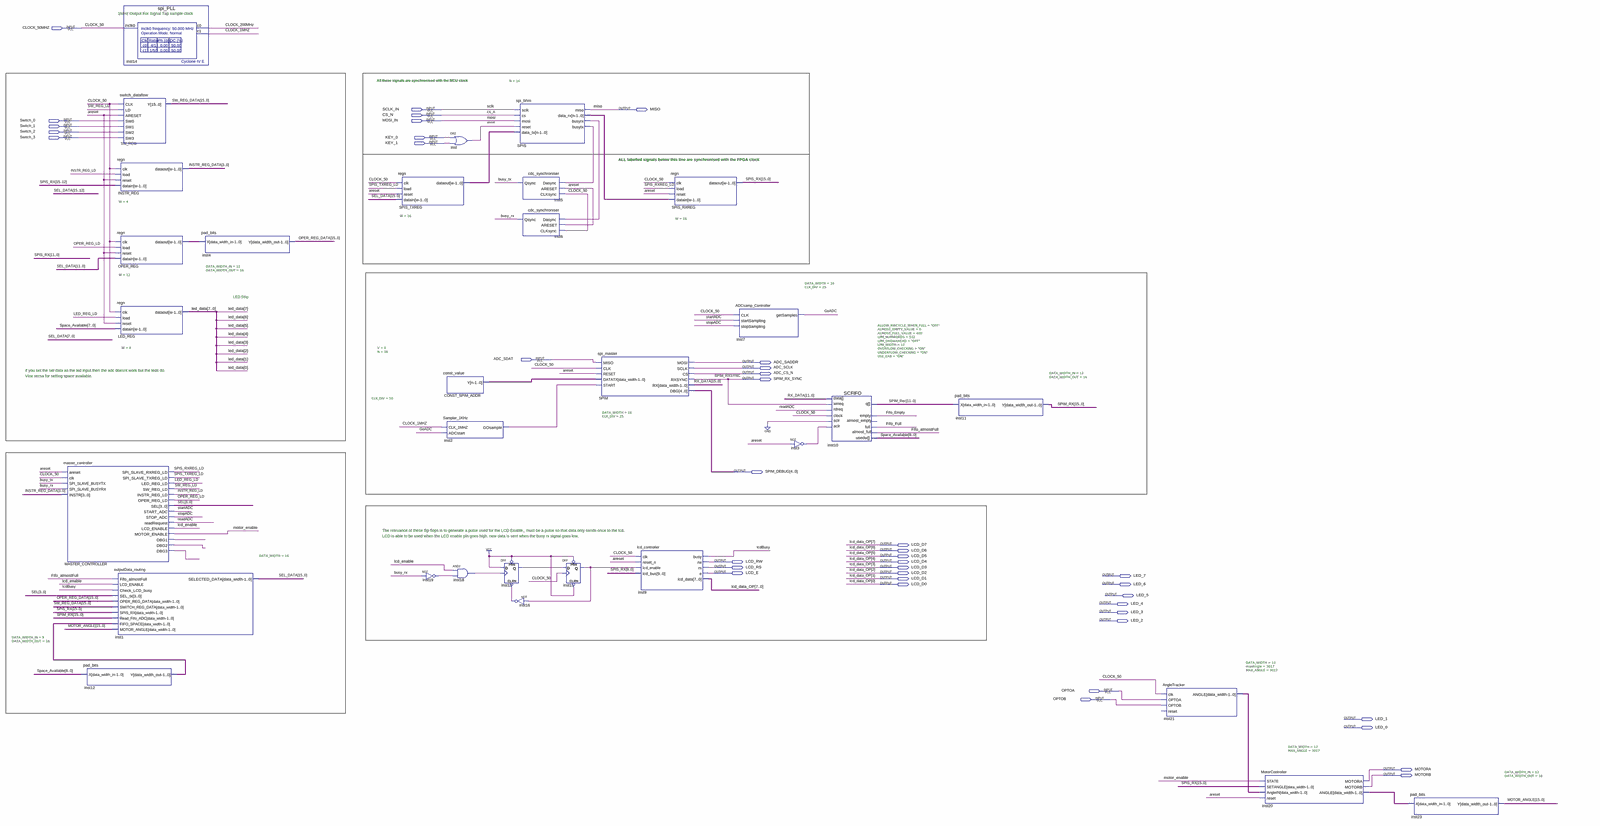
[diagram p0: schematic sheet, whole]
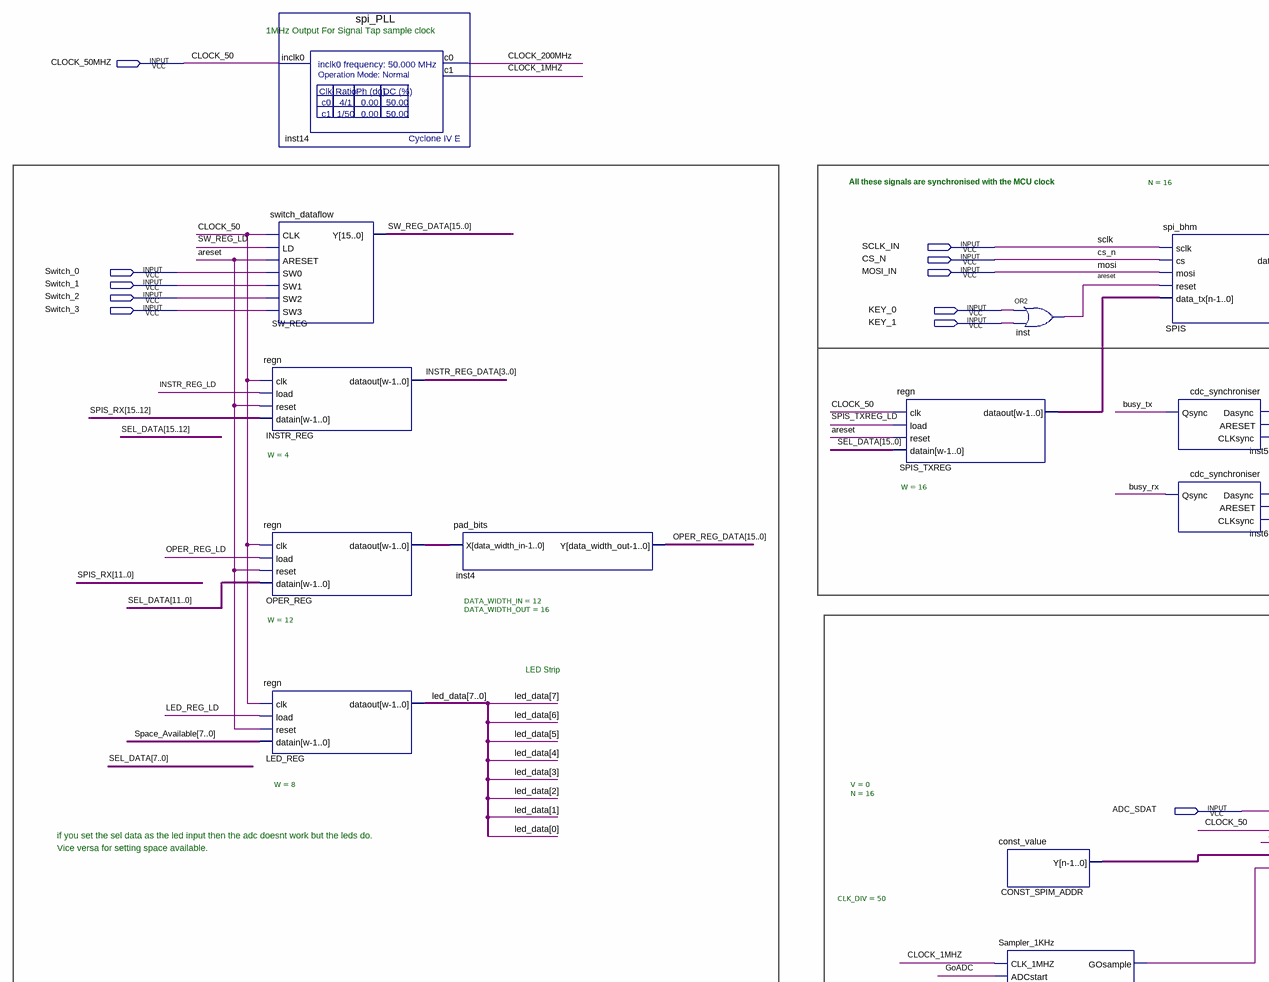
[diagram p1: schematic sheet, upper left part]
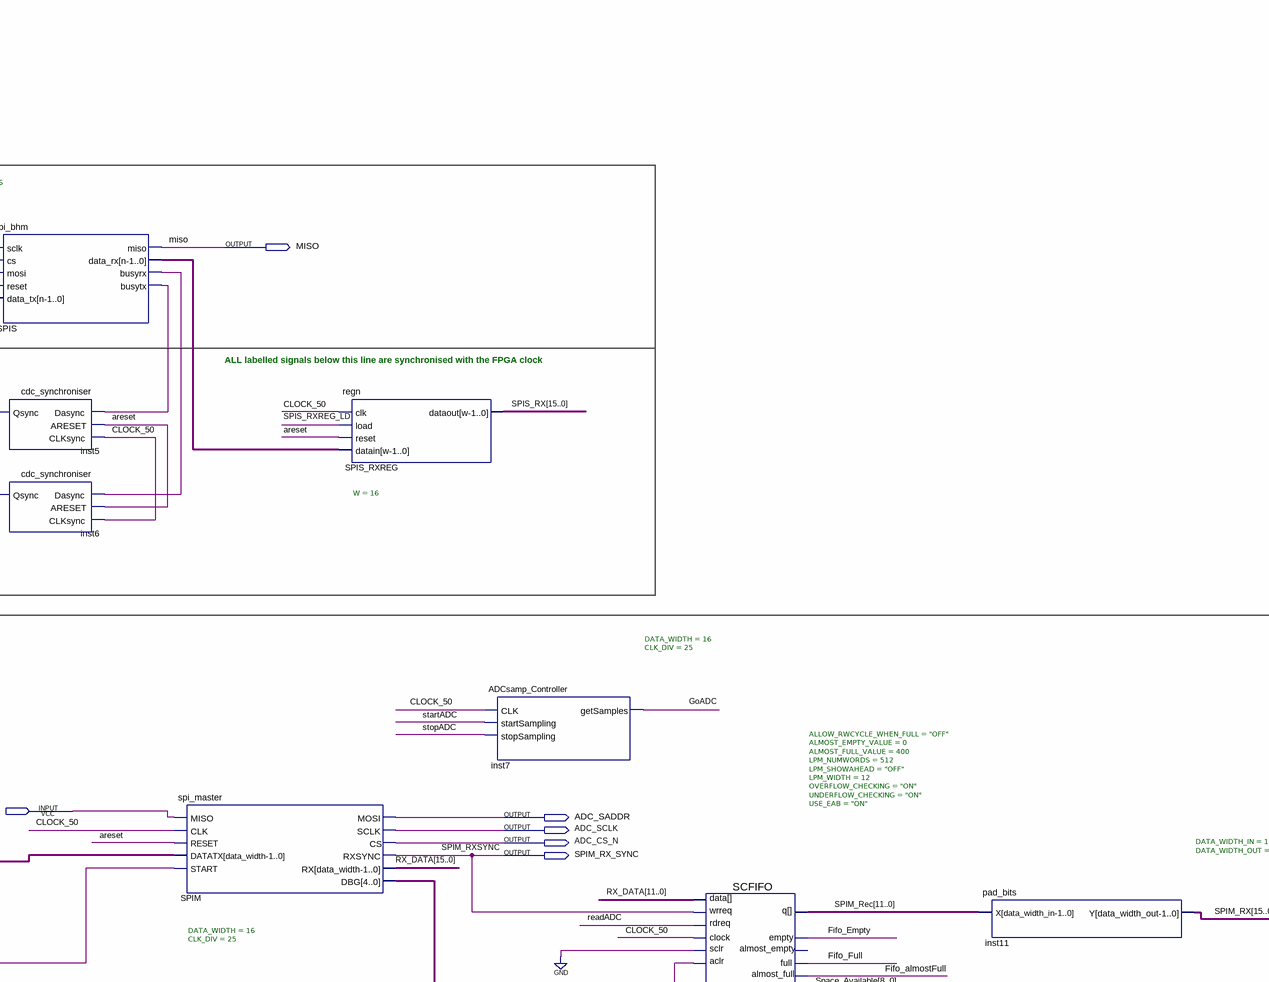
[diagram p2: schematic sheet, upper centre part]
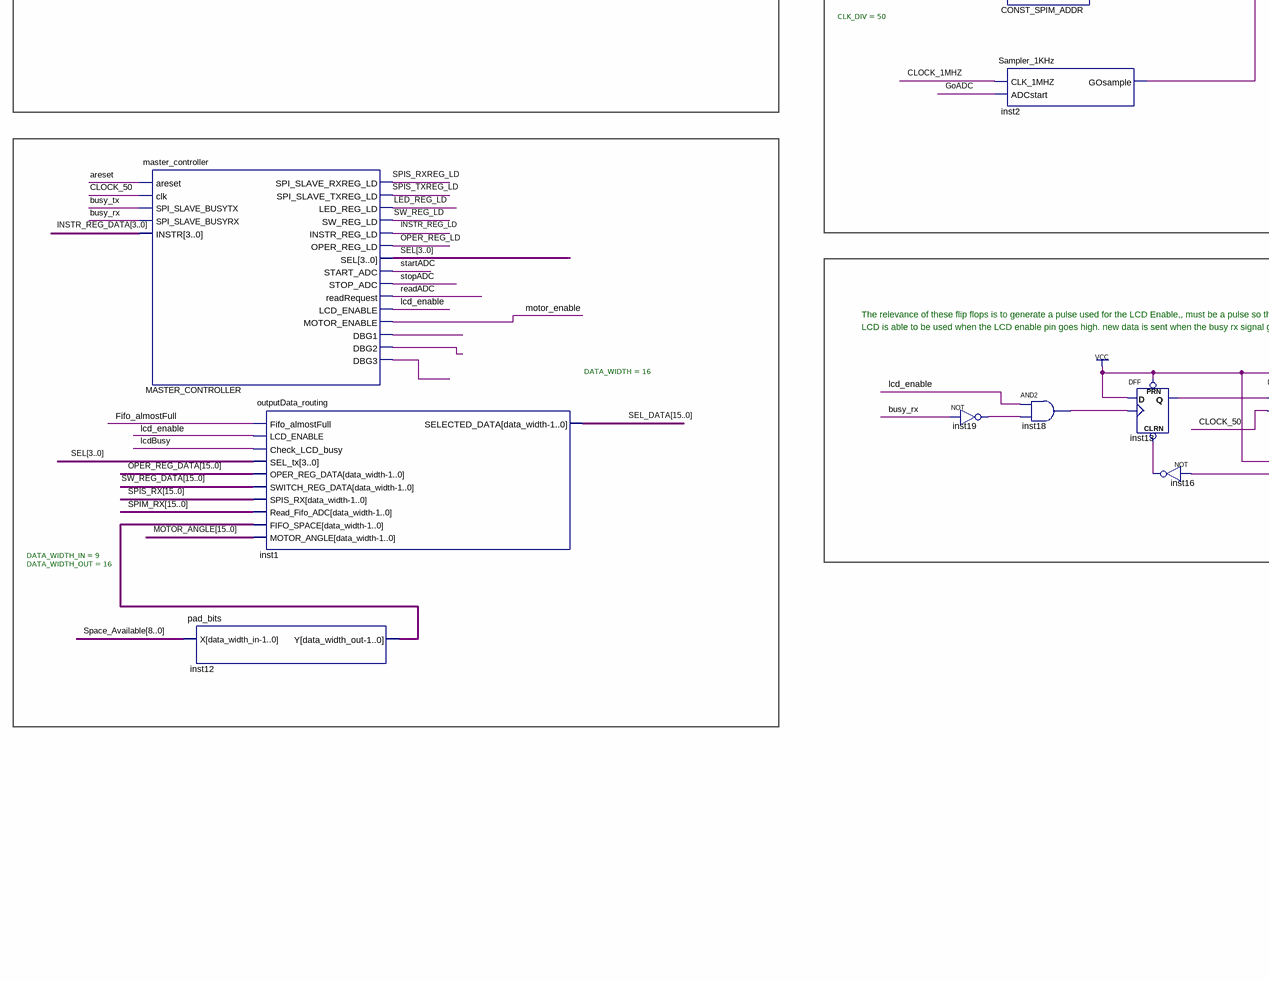
[diagram p3: schematic sheet, lower left part]
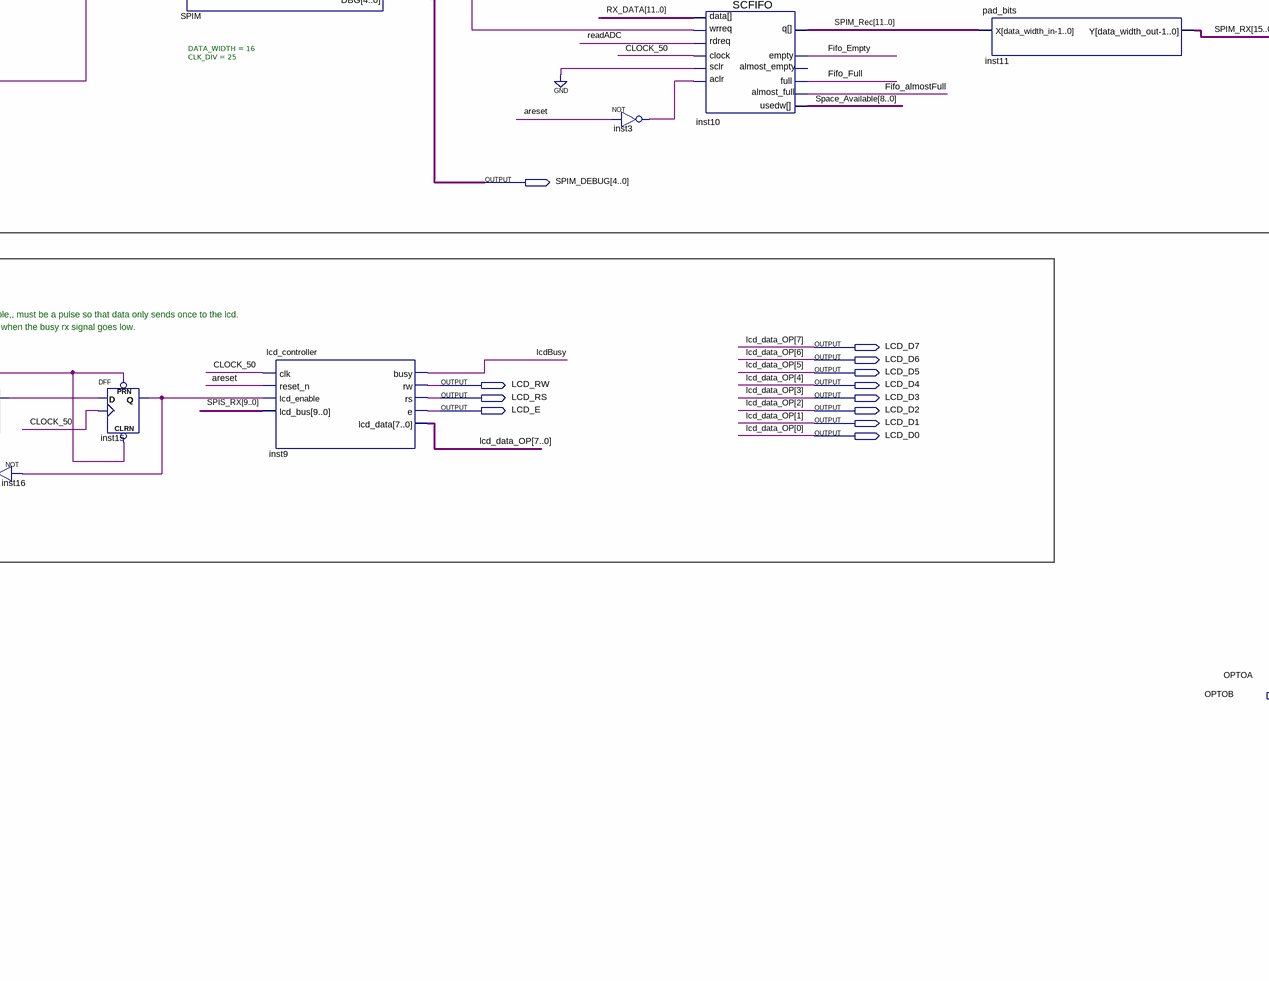
[diagram p4: schematic sheet, lower centre part]
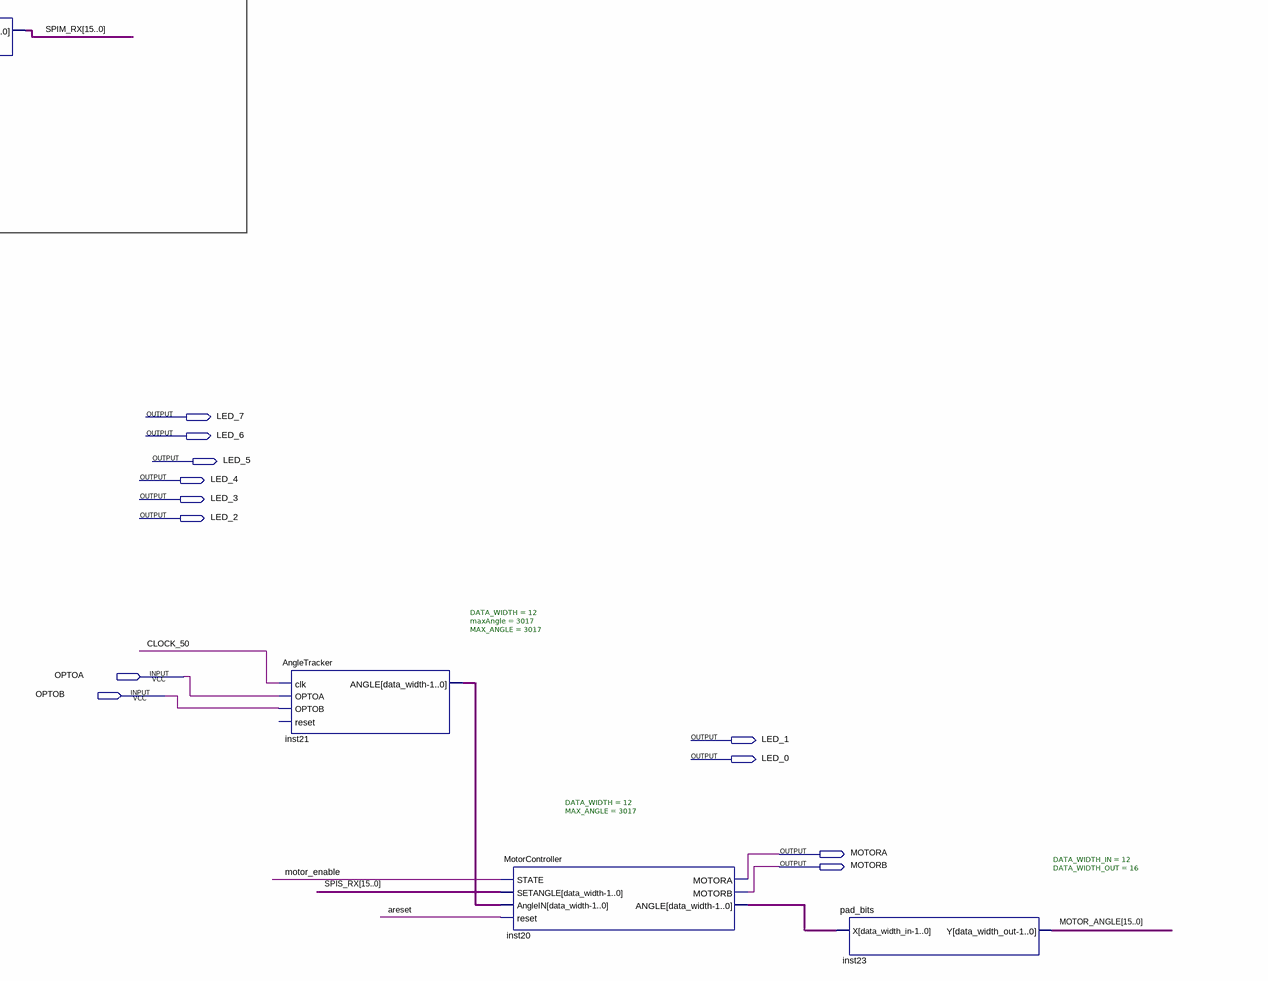
[diagram p5: schematic sheet, lower right part]
// Quartus schematic spi_test.bdf as structural Verilog: 31 symbols, 40 pins
module spi_test (
  input  CLOCK_50MHZ,
  input  SCLK_IN,
  input  CS_N,
  input  Switch_0,
  input  MOSI_IN,
  input  Switch_1,
  input  Switch_2,
  input  Switch_3,
  input  KEY_0,
  input  KEY_1,
  input  ADC_SDAT,
  input  OPTOA,
  input  OPTOB,
  output MISO,
  output ADC_SADDR,
  output ADC_SCLK,
  output ADC_CS_N,
  output SPIM_RX_SYNC,
  output [4:0] SPIM_DEBUG,
  output LCD_D7,
  output LCD_D6,
  output LCD_D5,
  output LCD_RW,
  output LCD_D4,
  output LCD_RS,
  output LCD_D3,
  output LCD_E,
  output LCD_D2,
  output LED_7,
  output LCD_D1,
  output LCD_D0,
  output LED_6,
  output LED_5,
  output LED_4,
  output LED_3,
  output LED_2,
  output LED_1,
  output LED_0,
  output MOTORA,
  output MOTORB
);

  wire areset, busy_rx, busy_tx, CLOCK_1MHZ, CLOCK_200MHz, Fifo_almostFull, Fifo_Empty, Fifo_Full, GoADC,
       inst2_gosample, inst3_out, inst13_q, inst15_q, inst16_out, inst18_out, inst19_out, INSTR_REG_LD,
       lcd_enable, lcdBusy, LED_REG_LD, MASTER_CONTROLLER_dbg1, MASTER_CONTROLLER_dbg2,
       MASTER_CONTROLLER_dbg3, motor_enable, OPER_REG_LD, readADC, SPIS_busyrx, SPIS_busytx, SPIS_RXREG_LD,
       SPIS_TXREG_LD, startADC, stopADC, SW_REG_LD;
  wire [3:0] INSTR_REG_DATA, SEL;
  wire [7:0] led_data;
  wire [8:0] Space_Available;
  wire [11:0] inst20_angle, inst21_angle, OPER_REG_dataout, SPIM_Rec;
  wire [15:0] CONST_SPIM_ADDR_y, inst12_y, MOTOR_ANGLE, OPER_REG_DATA, RX_DATA, SEL_DATA, SPIM_RX,
       SPIS_data_rx, SPIS_RX, SPIS_TXREG_dataout, SW_REG_DATA;

  master_controller MASTER_CONTROLLER (
    .areset(areset), .clk(CLOCK_50MHZ), .SPI_SLAVE_BUSYTX(busy_tx), .SPI_SLAVE_BUSYRX(busy_rx),
    .INSTR(INSTR_REG_DATA), .SPI_SLAVE_RXREG_LD(SPIS_RXREG_LD), .SPI_SLAVE_TXREG_LD(SPIS_TXREG_LD),
    .LED_REG_LD(LED_REG_LD), .SW_REG_LD(SW_REG_LD), .INSTR_REG_LD(INSTR_REG_LD), .OPER_REG_LD(OPER_REG_LD),
    .SEL(SEL), .START_ADC(startADC), .STOP_ADC(stopADC), .readRequest(readADC), .LCD_ENABLE(lcd_enable),
    .MOTOR_ENABLE(motor_enable), .DBG1(MASTER_CONTROLLER_dbg1), .DBG2(MASTER_CONTROLLER_dbg2),
    .DBG3(MASTER_CONTROLLER_dbg3));
  pad_bits #(.DATA_WIDTH_IN(9), .DATA_WIDTH_OUT(16)) inst12 (.X(Space_Available), .Y(inst12_y));
  switch_dataflow SW_REG (
    .CLK(CLOCK_50MHZ), .LD(SW_REG_LD), .ARESET(areset), .SW0(Switch_0), .SW1(Switch_1), .SW2(Switch_2),
    .SW3(Switch_3), .Y(SW_REG_DATA));
  regn #(.W(4)) INSTR_REG (
    .clk(CLOCK_50MHZ), .load(INSTR_REG_LD), .reset(areset), .datain(SPIS_RX[15:12]), .dataout(INSTR_REG_DATA));
  regn #(.W(12)) OPER_REG (
    .clk(CLOCK_50MHZ), .load(OPER_REG_LD), .reset(areset), .datain(SEL_DATA[11:0]), .dataout(OPER_REG_dataout));
  regn #(.W(8)) LED_REG (
    .clk(CLOCK_50MHZ), .load(LED_REG_LD), .reset(areset), .datain(Space_Available[7:0]), .dataout(led_data));
  outputData_routing #(.DATA_WIDTH(16)) inst1 (
    .Fifo_almostFull(Fifo_almostFull), .LCD_ENABLE(lcd_enable), .Check_LCD_busy(lcdBusy), .SEL_tx(SEL),
    .OPER_REG_DATA(OPER_REG_DATA), .SWITCH_REG_DATA(SW_REG_DATA), .SPIS_RX(SPIS_RX), .Read_Fifo_ADC(SPIM_RX),
    .FIFO_SPACE(inst12_y), .MOTOR_ANGLE(MOTOR_ANGLE), .SELECTED_DATA(SEL_DATA));
  spi_PLL inst14 (.inclk0(CLOCK_50MHZ), .c0(CLOCK_200MHz), .c1(CLOCK_1MHZ));
  pad_bits #(.DATA_WIDTH_IN(12), .DATA_WIDTH_OUT(16)) inst4 (.X(OPER_REG_dataout), .Y(OPER_REG_DATA));
  regn #(.W(16)) SPIS_TXREG (
    .clk(CLOCK_50MHZ), .load(SPIS_TXREG_LD), .reset(areset), .datain(SEL_DATA), .dataout(SPIS_TXREG_dataout));
  not inst19 (inst19_out, busy_rx);
  or inst (areset, KEY_0, KEY_1);
  const_value #(.V(0), .N(16)) CONST_SPIM_ADDR (.Y(CONST_SPIM_ADDR_y));
  Sampler_1KHz #(.CLK_DIV(50)) inst2 (.CLK_1MHZ(CLOCK_1MHZ), .ADCstart(GoADC), .GOsample(inst2_gosample));
  and inst18 (inst18_out, lcd_enable, inst19_out);
  DFF inst13 (.CLRN(inst16_out), .CLK(inst18_out), .D(1'b1), .PRN(1'b1), .Q(inst13_q));
  spi_bhm #(.N(16)) SPIS (
    .sclk(SCLK_IN), .cs(CS_N), .mosi(MOSI_IN), .reset(areset), .data_tx(SPIS_TXREG_dataout), .miso(MISO),
    .data_rx(SPIS_data_rx), .busyrx(SPIS_busyrx), .busytx(SPIS_busytx));
  cdc_synchroniser inst5 (.Dasync(SPIS_busytx), .ARESET(areset), .CLKsync(CLOCK_50MHZ), .Qsync(busy_tx));
  cdc_synchroniser inst6 (.Dasync(SPIS_busyrx), .ARESET(areset), .CLKsync(CLOCK_50MHZ), .Qsync(busy_rx));
  not inst16 (inst16_out, inst15_q);
  DFF inst15 (.CLRN(1'b1), .CLK(CLOCK_50MHZ), .D(inst13_q), .PRN(1'b1), .Q(inst15_q));
  spi_master #(.DATA_WIDTH(16), .CLK_DIV(25)) SPIM (
    .MISO(ADC_SDAT), .CLK(CLOCK_50MHZ), .RESET(areset), .DATATX(CONST_SPIM_ADDR_y), .START(inst2_gosample),
    .MOSI(ADC_SADDR), .SCLK(ADC_SCLK), .CS(ADC_CS_N), .RXSYNC(SPIM_RX_SYNC), .RX(RX_DATA), .DBG(SPIM_DEBUG));
  lcd_controller inst9 (
    .clk(CLOCK_50MHZ), .reset_n(areset), .lcd_enable(inst15_q), .lcd_bus(SPIS_RX[9:0]), .busy(lcdBusy),
    .rw(LCD_RW), .rs(LCD_RS), .e(LCD_E),
    .lcd_data({LCD_D7, LCD_D6, LCD_D5, LCD_D4, LCD_D3, LCD_D2, LCD_D1, LCD_D0}));
  regn #(.W(16)) SPIS_RXREG (
    .clk(CLOCK_50MHZ), .load(SPIS_RXREG_LD), .reset(areset), .datain(SPIS_data_rx), .dataout(SPIS_RX));
  ADCsamp_Controller #(.DATA_WIDTH(16), .CLK_DIV(25)) inst7 (
    .CLK(CLOCK_50MHZ), .startSampling(startADC), .stopSampling(stopADC), .getSamples(GoADC));
  not inst3 (inst3_out, areset);
  SCFIFO #(.ALLOW_RWCYCLE_WHEN_FULL("OFF"), .ALMOST_EMPTY_VALUE(0), .ALMOST_FULL_VALUE(400), .LPM_NUMWORDS(512), .LPM_SHOWAHEAD("OFF"), .LPM_WIDTH(12), .OVERFLOW_CHECKING("ON"), .UNDERFLOW_CHECKING("ON"), .USE_EAB("ON")) inst10 (
    .clock(CLOCK_50MHZ), .data(RX_DATA[11:0]), .wrreq(SPIM_RX_SYNC), .rdreq(readADC), .aclr(inst3_out),
    .sclr(1'b0), .q(SPIM_Rec), .empty(Fifo_Empty), .full(Fifo_Full), .usedw(Space_Available),
    .almost_full(Fifo_almostFull));  // open: almost_empty
  pad_bits #(.DATA_WIDTH_IN(12), .DATA_WIDTH_OUT(16)) inst11 (.X(SPIM_Rec), .Y(SPIM_RX));
  AngleTracker #(.DATA_WIDTH(12), .maxAngle(3017), .MAX_ANGLE(3017)) inst21 (
    .clk(CLOCK_50MHZ), .OPTOA(OPTOA), .OPTOB(OPTOB), .ANGLE(inst21_angle));  // open: reset
  MotorController #(.DATA_WIDTH(12), .MAX_ANGLE(3017)) inst20 (
    .STATE(motor_enable), .SETANGLE(SPIS_RX), .AngleIN(inst21_angle), .reset(areset), .MOTORA(MOTORA),
    .MOTORB(MOTORB), .ANGLE(inst20_angle));
  pad_bits #(.DATA_WIDTH_IN(12), .DATA_WIDTH_OUT(16)) inst23 (.X(inst20_angle), .Y(MOTOR_ANGLE));

  // Other names for the same wires on the sheet: CLOCK_50 = CLOCK_50MHZ;
  //   lcd_data_OP[7:0] = {LCD_D7, LCD_D6, LCD_D5, LCD_D4, LCD_D3, LCD_D2, LCD_D1, LCD_D0}; mosi = MOSI_IN;
  //   sclk = SCLK_IN; SPIM_RXSYNC = SPIM_RX_SYNC

  // Notes on the sheet:
  //   1MHz Output For Signal Tap sample clock
  //   All these signals are synchronised with the MCU clock
  //   ALL labelled signals below this line are synchronised with the FPGA clock
  //   LED Strip
  //   if you set the sel data as the led input then the adc doesnt work but the leds do. 
  //   Vice versa for setting space available. 
  //   The relevance of these flip flops is to generate a pulse used for the LCD Enable,, must be a pulse so that data only sends once to the lcd. 
  //   LCD is able to be used when the LCD enable pin goes high. new data is sent when the busy rx signal goes low. 
endmodule
